# Altium schematic sheet Cell+Balancing_Interface.SchDoc
size Letter; Website: www.uwmidsun.com
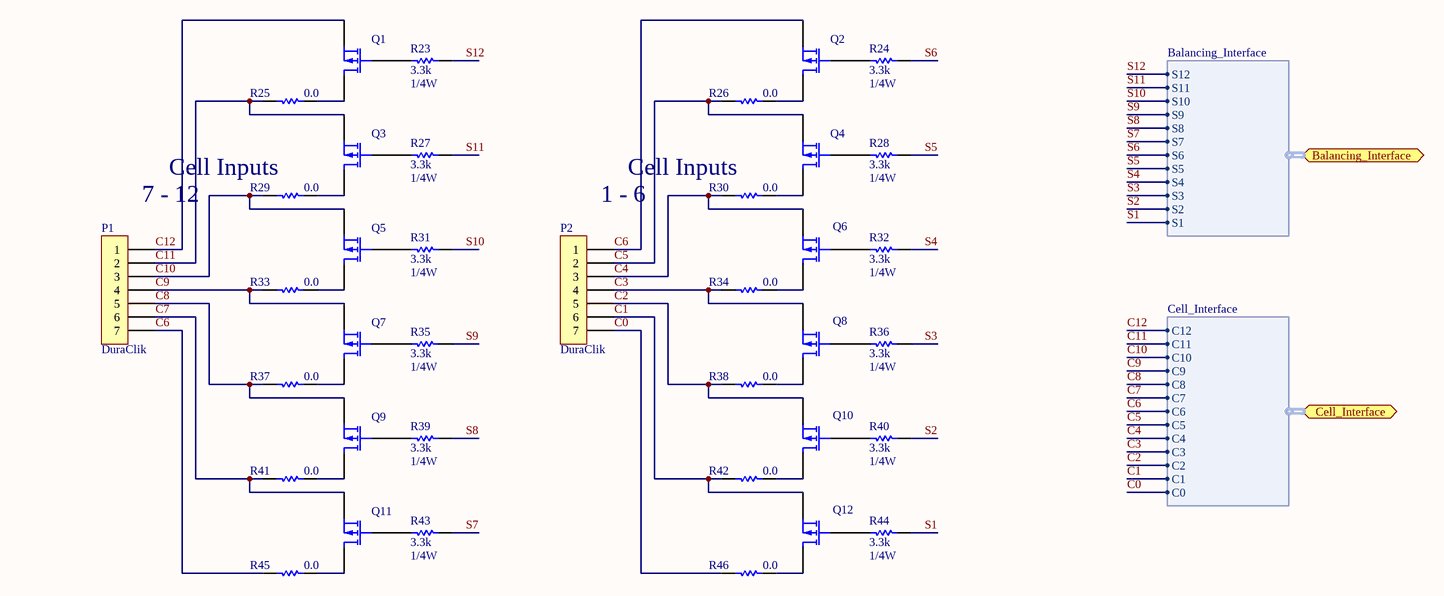
[diagram p0: Cell+Balancing_Interface.SchDoc]

## Parts
P1  Series: DuraClik  (hidden comment: CONN 7POS DURA-CLIK 0.079")
P2  Series: DuraClik  (hidden comment: CONN 7POS DURA-CLIK 0.079")
Q1  MOSFET P-CH 16V 2.5A X2-DFN2015  (value not drawn)
Q2  MOSFET P-CH 16V 2.5A X2-DFN2015  (value not drawn)
Q3  MOSFET P-CH 16V 2.5A X2-DFN2015  (value not drawn)
Q4  MOSFET P-CH 16V 2.5A X2-DFN2015  (value not drawn)
Q5  MOSFET P-CH 16V 2.5A X2-DFN2015  (value not drawn)
Q6  MOSFET P-CH 16V 2.5A X2-DFN2015  (value not drawn)
Q7  MOSFET P-CH 16V 2.5A X2-DFN2015  (value not drawn)
Q8  MOSFET P-CH 16V 2.5A X2-DFN2015  (value not drawn)
Q9  MOSFET P-CH 16V 2.5A X2-DFN2015  (value not drawn)
Q10  MOSFET P-CH 16V 2.5A X2-DFN2015  (value not drawn)
Q11  MOSFET P-CH 16V 2.5A X2-DFN2015  (value not drawn)
Q12  MOSFET P-CH 16V 2.5A X2-DFN2015  (value not drawn)
R23  Resistance: 3.3k  Power: 1/4W  [RES, 0603]  (hidden comment: RES 3.3K OHM 1% 1/4W 0603)
R24  Resistance: 3.3k  Power: 1/4W  [RES, 0603]  (hidden comment: RES 3.3K OHM 1% 1/4W 0603)
R25  Resistance: 0.0  [RES, 0603]  (hidden comment: RES 0.0 OHM 1/4W 0603)
R26  Resistance: 0.0  [RES, 0603]  (hidden comment: RES 0.0 OHM 1/4W 0603)
R27  Resistance: 3.3k  Power: 1/4W  [RES, 0603]  (hidden comment: RES 3.3K OHM 1% 1/4W 0603)
R28  Resistance: 3.3k  Power: 1/4W  [RES, 0603]  (hidden comment: RES 3.3K OHM 1% 1/4W 0603)
R29  Resistance: 0.0  [RES, 0603]  (hidden comment: RES 0.0 OHM 1/4W 0603)
R30  Resistance: 0.0  [RES, 0603]  (hidden comment: RES 0.0 OHM 1/4W 0603)
R31  Resistance: 3.3k  Power: 1/4W  [RES, 0603]  (hidden comment: RES 3.3K OHM 1% 1/4W 0603)
R32  Resistance: 3.3k  Power: 1/4W  [RES, 0603]  (hidden comment: RES 3.3K OHM 1% 1/4W 0603)
R33  Resistance: 0.0  [RES, 0603]  (hidden comment: RES 0.0 OHM 1/4W 0603)
R34  Resistance: 0.0  [RES, 0603]  (hidden comment: RES 0.0 OHM 1/4W 0603)
R35  Resistance: 3.3k  Power: 1/4W  [RES, 0603]  (hidden comment: RES 3.3K OHM 1% 1/4W 0603)
R36  Resistance: 3.3k  Power: 1/4W  [RES, 0603]  (hidden comment: RES 3.3K OHM 1% 1/4W 0603)
R37  Resistance: 0.0  [RES, 0603]  (hidden comment: RES 0.0 OHM 1/4W 0603)
R38  Resistance: 0.0  [RES, 0603]  (hidden comment: RES 0.0 OHM 1/4W 0603)
R39  Resistance: 3.3k  Power: 1/4W  [RES, 0603]  (hidden comment: RES 3.3K OHM 1% 1/4W 0603)
R40  Resistance: 3.3k  Power: 1/4W  [RES, 0603]  (hidden comment: RES 3.3K OHM 1% 1/4W 0603)
R41  Resistance: 0.0  [RES, 0603]  (hidden comment: RES 0.0 OHM 1/4W 0603)
R42  Resistance: 0.0  [RES, 0603]  (hidden comment: RES 0.0 OHM 1/4W 0603)
R43  Resistance: 3.3k  Power: 1/4W  [RES, 0603]  (hidden comment: RES 3.3K OHM 1% 1/4W 0603)
R44  Resistance: 3.3k  Power: 1/4W  [RES, 0603]  (hidden comment: RES 3.3K OHM 1% 1/4W 0603)
R45  Resistance: 0.0  [RES, 0603]  (hidden comment: RES 0.0 OHM 1/4W 0603)
R46  Resistance: 0.0  [RES, 0603]  (hidden comment: RES 0.0 OHM 1/4W 0603)

## Ports
Balancing_Interface (harness Balancing_Interface), Cell_Interface (harness Cell_Interface)

## Harnesses
Cell_Interface: C12, C11, C10, C9, C8, C7, C6, C5, C4, C3, C2, C1, C0
Balancing_Interface: S12, S11, S10, S9, S8, S7, S6, S5, S4, S3, S2, S1

## Nets
C0: P2.7 R46.2 ; port Cell_Interface.C0
C1: P2.6 Q12.2(S) R42.2 ; port Cell_Interface.C1
C2: P2.5 Q10.2(S) R38.2 ; port Cell_Interface.C2
C3: P2.4 Q8.2(S) R34.2 ; port Cell_Interface.C3
C4: P2.3 Q6.2(S) R30.2 ; port Cell_Interface.C4
C5: P2.2 Q4.2(S) R26.2 ; port Cell_Interface.C5
C6: P1.7 P2.1 Q2.2(S) R45.2 ; port Cell_Interface.C6
C7: P1.6 Q11.2(S) R41.2 ; port Cell_Interface.C7
C8: P1.5 Q9.2(S) R37.2 ; port Cell_Interface.C8
C9: P1.4 Q7.2(S) R33.2 ; port Cell_Interface.C9
C10: P1.3 Q5.2(S) R29.2 ; port Cell_Interface.C10
C11: P1.2 Q3.2(S) R25.2 ; port Cell_Interface.C11
C12: P1.1 Q1.2(S) ; port Cell_Interface.C12
S1: R44.1 ; port Balancing_Interface.S1
S2: R40.1 ; port Balancing_Interface.S2
S3: R36.1 ; port Balancing_Interface.S3
S4: R32.1 ; port Balancing_Interface.S4
S5: R28.1 ; port Balancing_Interface.S5
S6: R24.1 ; port Balancing_Interface.S6
S7: R43.1 ; port Balancing_Interface.S7
S8: R39.1 ; port Balancing_Interface.S8
S9: R35.1 ; port Balancing_Interface.S9
S10: R31.1 ; port Balancing_Interface.S10
S11: R27.1 ; port Balancing_Interface.S11
S12: R23.1 ; port Balancing_Interface.S12
NetQ1_1: Q1.1(G) R23.2
NetQ1_3: Q1.3(D) R25.1
NetQ2_1: Q2.1(G) R24.2
NetQ2_3: Q2.3(D) R26.1
NetQ3_1: Q3.1(G) R27.2
NetQ3_3: Q3.3(D) R29.1
NetQ4_1: Q4.1(G) R28.2
NetQ4_3: Q4.3(D) R30.1
NetQ5_1: Q5.1(G) R31.2
NetQ5_3: Q5.3(D) R33.1
NetQ6_1: Q6.1(G) R32.2
NetQ6_3: Q6.3(D) R34.1
NetQ7_1: Q7.1(G) R35.2
NetQ7_3: Q7.3(D) R37.1
NetQ8_1: Q8.1(G) R36.2
NetQ8_3: Q8.3(D) R38.1
NetQ9_1: Q9.1(G) R39.2
NetQ9_3: Q9.3(D) R41.1
NetQ10_1: Q10.1(G) R40.2
NetQ10_3: Q10.3(D) R42.1
NetQ11_1: Q11.1(G) R43.2
NetQ11_3: Q11.3(D) R45.1
NetQ12_1: Q12.1(G) R44.2
NetQ12_3: Q12.3(D) R46.1

## Notes on the sheet
- Cell Inputs
- (near P1) 7 - 12
- (near P2) 1 - 6
- Project:
- Title:
- Size:
- Project Lead:
- Letter
- Revision:
- University of Waterloo
- 200 University Ave W
- Waterloo, ON, Canada
- N2L 3E9
- Date:
- Sheet
- of
- Website:

## Library data of the parts
P1 P2 = CONN 7POS DURA-CLIK 0.079": 7 Positions Header Connector 0.079" (2.00mm) Surface Mount Tin; Manufacturer 1: Molex, LLC; Manufacturer Part Number 1: 5600200720; Style: Board to Cable/Wire; Shrouding: Shrouded - 4 Wall; Number of Positions: 7; Number of Positions Loaded: All; Mated Stacking Heights: 9.3mm; Supplier 1: Digi-Key; Supplier Part Number 1: WM10867CT-ND; Packaging: Cut Tape (CT); Part Status: Active; Connector Type: Header; Contact Type: Male Pin; Pitch - Mating: 0.079" (2.00mm); Number of Rows: 1; Row Spacing - Mating: -; Mounting Type: Surface Mount; Termination: Solder; Fastening Type: Latch Lock; Contact Length - Mating: -; Contact Length - Post: -; Overall Contact Length: -; Insulation Height: 0.315" (8.00mm); Contact Shape: Square; Contact Finish - Mating: Tin; Contact Finish Thickness - Mating: -; Contact Finish - Post: Tin; Contact Material: Copper Alloy; Insulation Material: Polyamide (PA), Nylon; Operating Temperature: -; Ingress Protection: -; Material Flammability Rating: -; Insulation Color: Natural; Current Rating: -; Contact Finish Thickness - Post: -; ComponentLink1URL: http://www.molex.com/pdm_docs/sd/5600200720_sd.pdf; ComponentLink1Description: http://www.molex.com/pdm_docs/sd/5600200720_sd.pdf; Voltage: -
Q1-Q12 = MOSFET P-CH 16V 2.5A X2-DFN2015: P-Channel 16V 2.5A (Ta) 650mW (Ta) Surface Mount X2-DFN2015-3; Manufacturer 1: Diodes Incorporated; Manufacturer Part Number 1: DMG3415UFY4Q-7; Drive Voltage (Max Rds On,  Min Rds On): 1.8V, 4.5V; Vgs(th) (Max) @ Id: 1V @ 250µA; Gate Charge (Qg) (Max) @ Vgs: 10nC @ 4.5V; Input Capacitance (Ciss) (Max) @ Vds: 282pF @ 10V; Vgs (Max): ±8V; Rds On (Max) @ Id, Vgs: 39 mOhm @ 4A, 4.5V; Supplier 1: Digi-Key; Supplier Part Number 1: DMG3415UFY4Q-7DICT-ND; Packaging: Cut Tape (CT); Part Status: Active; FET Type: P-Channel; Technology: MOSFET (Metal Oxide); Drain to Source Voltage (Vdss): 16V; Current - Continuous Drain (Id) @ 25°C: 2.5A (Ta); FET Feature: -; Power Dissipation (Max): 650mW (Ta); Operating Temperature: -55°C ~ 150°C (TJ); Mounting Type: Surface Mount; Supplier Device Package: X2-DFN2015-3; Package / Case: 3-XFDFN; ComponentLink1URL: https://www.diodes.com/assets/Datasheets/DMG3415UFY4Q.pdf; ComponentLink1Description: https://www.diodes.com/assets/Datasheets/DMG3415UFY4Q.pdf
R23 R24 R27 R28 R31 R32 R35 R36 R39 R40 R43 R44 = RES 3.3K OHM 1% 1/4W 0603: 3.3k Ohm ±1% 0.25W, 1/4W Chip Resistor 0603 (1608 Metric) Automotive AEC-Q200, Pulse Withstanding Thick Film; Manufacturer 1: Panasonic Electronic Components; Manufacturer Part Number 1: ERJ-PA3F3301V; Temperature Coefficient: ±100ppm/°C; Supplier 1: Digi-Key; Supplier Part Number 1: P3.3KBYCT-ND; Packaging: Cut Tape (CT); Part Status: Active; Composition: Thick Film; Operating Temperature: -55°C ~ 155°C; Package / Case: 0603 (1608 Metric); Supplier Device Package: 0603; Size / Dimension: 0.063" L x 0.031" W (1.60mm x 0.80mm); Height - Seated (Max): 0.022" (0.55mm); Failure Rate: -; ComponentLink1URL: https://industrial.panasonic.com/cdbs/www-data/pdf/RDO0000/AOA0000C291.pdf; ComponentLink1Description: https://industrial.panasonic.com/cdbs/www-data/pdf/RDO0000/AOA0000C291.pdf; Tolerance: ±1%
R25 R26 R29 R30 R33 R34 R37 R38 R41 R42 R45 R46 = RES 0.0 OHM 1/4W 0603: RES SMD 0.0 OHM JUMPER 1/4W 0603; Manufacturer 1: Vishay Dale; Manufacturer Part Number 1: CRCW06030000Z0EAHP; Supplier 1: Digi-Key; Supplier Part Number 1: 541-0.0SBCT-ND; Packaging: Cut Tape (CT); Part Status: Active; Composition: Thick Film; Operating Temperature: -55°C ~ 155°C; Package / Case: 0603 (1608 Metric); Supplier Device Package: 0603; Size / Dimension: 0.063" L x 0.033" W (1.60mm x 0.85mm); Height - Seated (Max): 0.022" (0.55mm); Failure Rate: -; ComponentLink1URL: http://www.vishay.com/docs/20043/crcwhpe3.pdf; ComponentLink1Description: http://www.vishay.com/docs/20043/crcwhpe3.pdf; Power (Watts): 1/4W